# EAGLE design v1 (EAGLE 9.3.0)
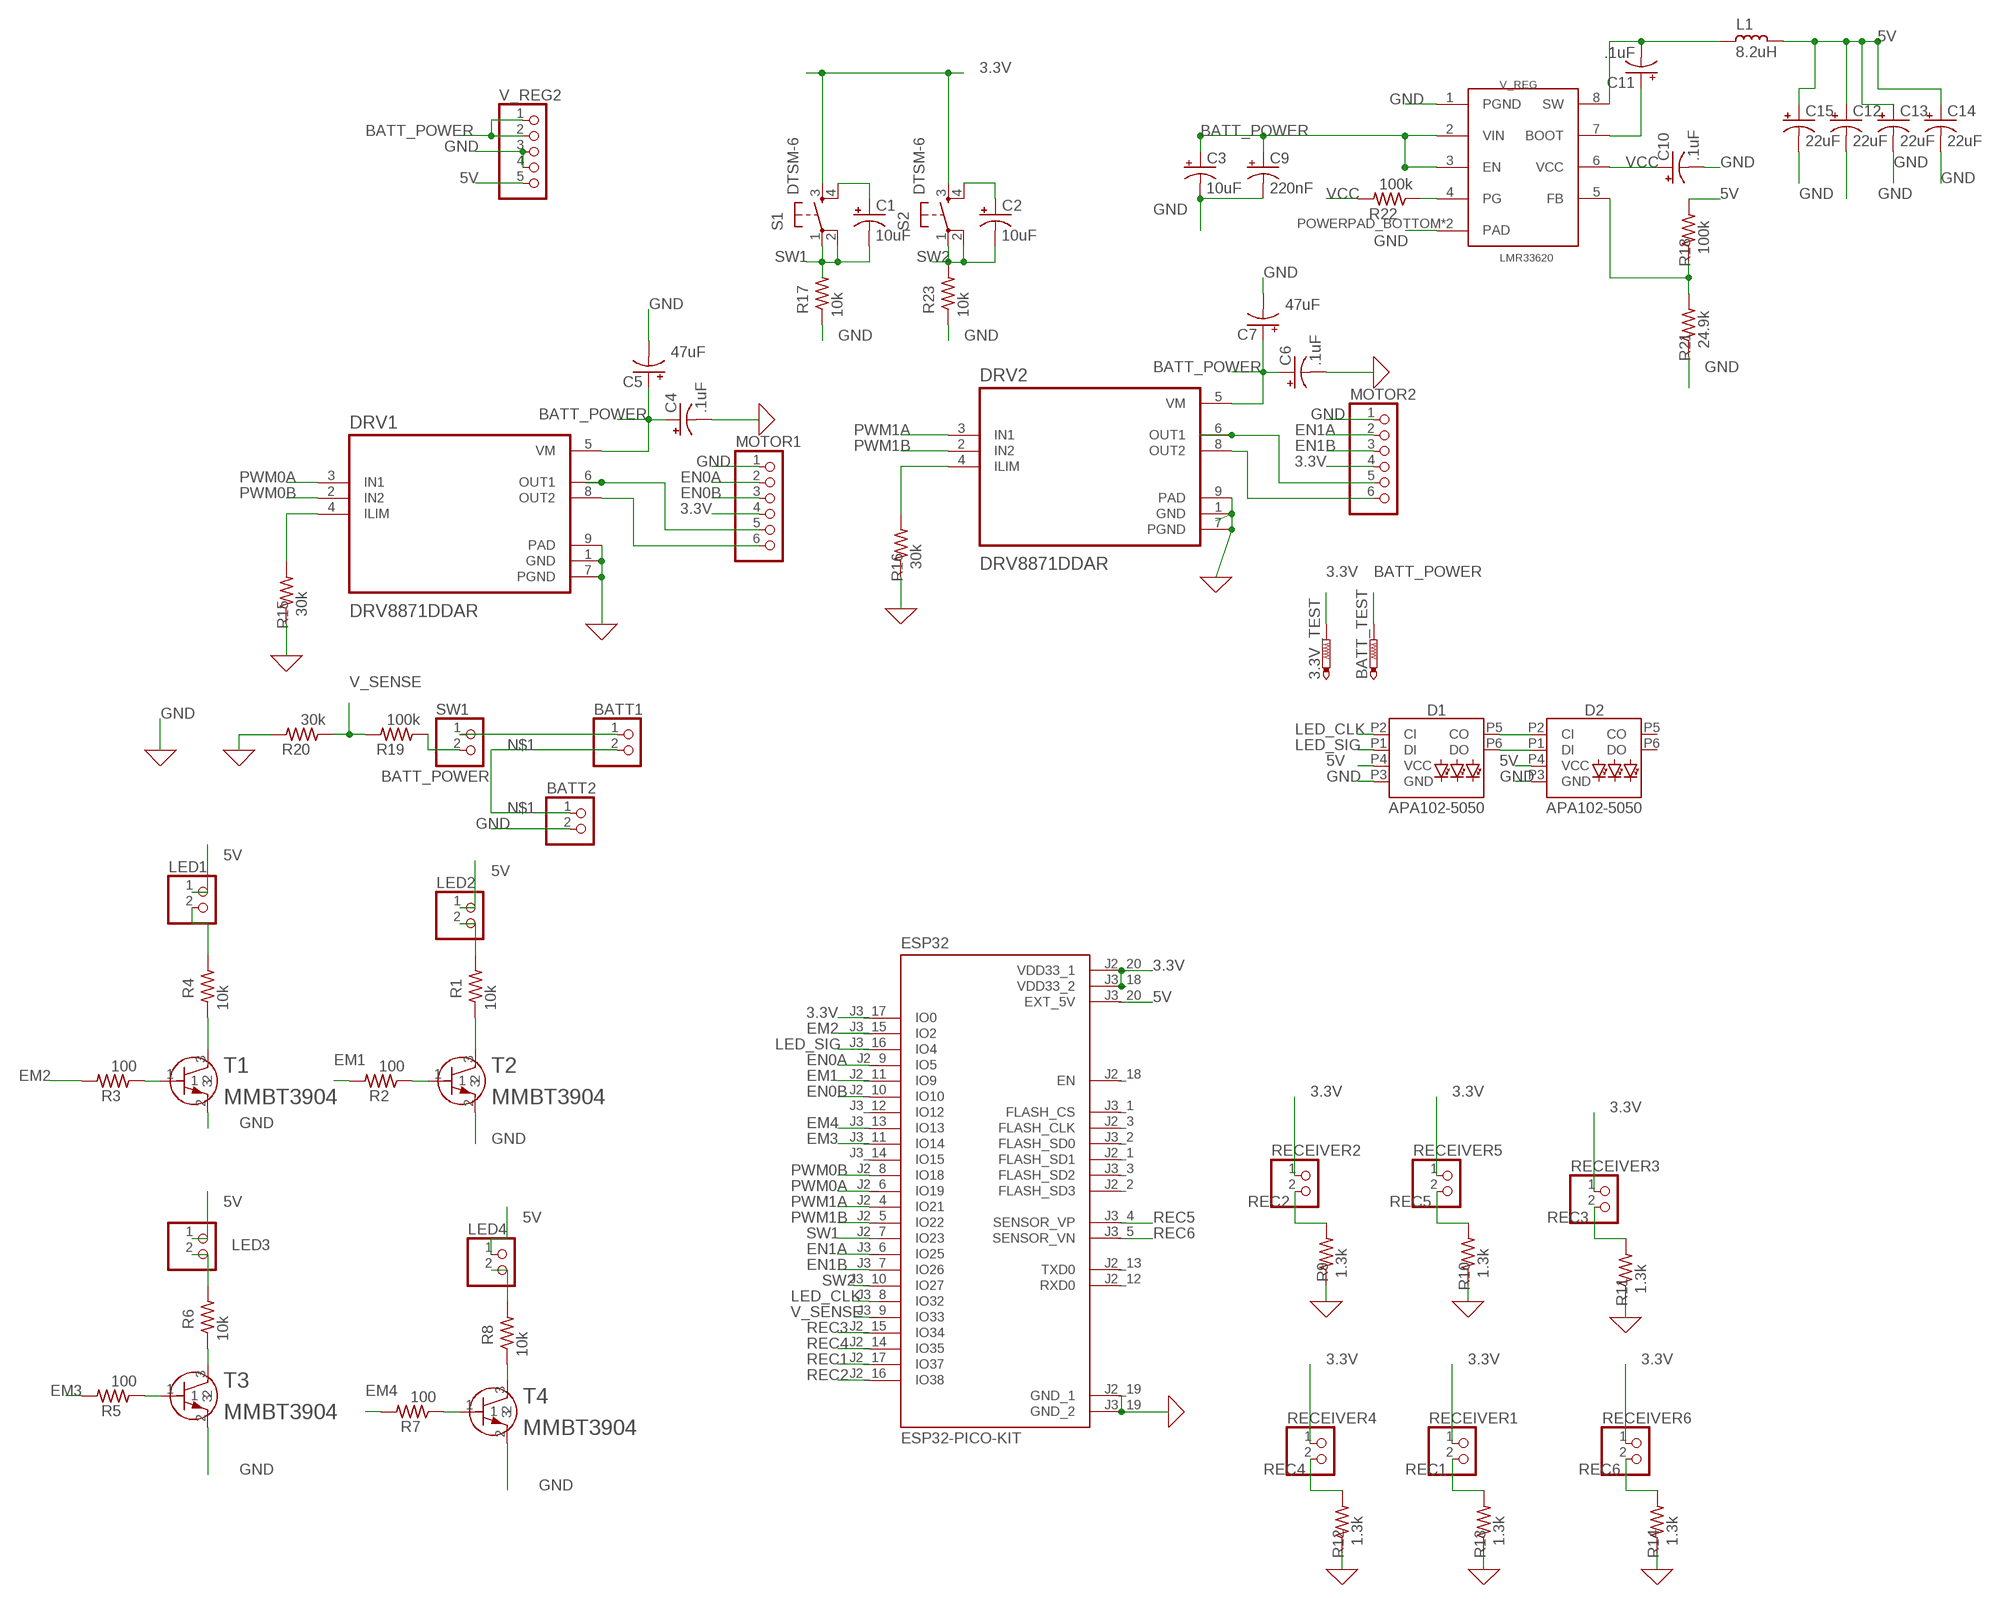
[diagram p0: schematic, sheet 1]

## Parts
3.3V_TEST  PTR1B1,27  [B1,27]
BATT1  PINHD-1X2  [1X02]
BATT2  PINHD-1X2  [1X02]
BATT_TEST  PTR1B1,27  [B1,27]
C1  10uF  CPOL-USA/3216-18R  [A/3216-18R]
C2  10uF  CPOL-USA/3216-18R  [A/3216-18R]
C3  10uF  CPOL-USA/3216-18R  [A/3216-18R]
C4  .1uF  CPOL-USA/3216-18R  [A/3216-18R]
C5  47uF  CPOL-US150CLZ-0810  [150CLZ-0810]
C6  .1uF  CPOL-USA/3216-18R  [A/3216-18R]
C7  47uF  CPOL-US150CLZ-0810  [150CLZ-0810]
C9  220nF  CPOL-USA/3216-18R  [A/3216-18R]
C10  .1uF  CPOL-USA/3216-18R  [A/3216-18R]
C11  .1uF  CPOL-USA/3216-18R  [A/3216-18R]
C12  22uF  CPOL-USA/3216-18R  [A/3216-18R]
C13  22uF  CPOL-USA/3216-18R  [A/3216-18R]
C14  22uF  CPOL-USA/3216-18R  [A/3216-18R]
C15  22uF  CPOL-USA/3216-18R  [A/3216-18R]
D1  APA102-5050  [APA102-5050]
D2  APA102-5050  [APA102-5050]
DRV1  DRV8871DDAR  [SOIC127P600X170-8N]
DRV2  DRV8871DDAR  [SOIC127P600X170-8N]
ESP32  ESP32-PICO-KIT  [XCVR_ESP32-PICO-KIT]
L1  8.2uH  L_PM1812  [PM1812]
LED1  PINHD-1X2  [1X02]
LED2  PINHD-1X2  [1X02]
LED3  PINHD-1X2  [1X02]
LED4  PINHD-1X2  [1X02]
MOTOR1  PINHD-1X6  [1X06]
MOTOR2  PINHD-1X6  [1X06]
R1  10k  R-US_M1206  [M1206]
R2  100  R-US_M1206  [M1206]
R3  100  R-US_M1206  [M1206]
R4  10k  R-US_M1206  [M1206]
R5  100  R-US_M1206  [M1206]
R6  10k  R-US_M1206  [M1206]
R7  100  R-US_M1206  [M1206]
R8  10k  R-US_M1206  [M1206]
R9  1.3k  R-US_M1206  [M1206]
R10  1.3k  R-US_M1206  [M1206]
R11  1.3k  R-US_M1206  [M1206]
R12  1.3k  R-US_M1206  [M1206]
R13  1.3k  R-US_M1206  [M1206]
R14  1.3k  R-US_M1206  [M1206]
R15  30k  R-US_M1206  [M1206]
R16  30k  R-US_M1206  [M1206]
R17  10k  R-US_M1206  [M1206]
R18  100k  R-US_M1206  [M1206]
R19  100k  R-US_M1206  [M1206]
R20  30k  R-US_M1206  [M1206]
R21  24.9k  R-US_M1206  [M1206]
R22  100k  R-US_M1206  [M1206]
R23  10k  R-US_M1206  [M1206]
RECEIVER1  PINHD-1X2  [1X02]
RECEIVER2  PINHD-1X2  [1X02]
RECEIVER3  PINHD-1X2  [1X02]
RECEIVER4  PINHD-1X2  [1X02]
RECEIVER5  PINHD-1X2  [1X02]
RECEIVER6  PINHD-1X2  [1X02]
S1  DTSM-6  [DTSM-6]
S2  DTSM-6  [DTSM-6]
SW1  PINHD-1X2  [1X02]
T1  MMBT3904  [SOT23]
T2  MMBT3904  [SOT23]
T3  MMBT3904  [SOT23]
T4  MMBT3904  [SOT23]
V_REG  LMR33620  [SO-8_POWERPAD]
V_REG2  PINHD-1X5  [1X05]

## Nets
3.3V: 3.3V_TEST.TP ESP32.J2_20(VDD33_1) ESP32.J3_17(IO0) ESP32.J3_18(VDD33_2) MOTOR1.4 MOTOR2.4 RECEIVER1.1 RECEIVER2.1 RECEIVER3.1 RECEIVER4.1 RECEIVER5.1 RECEIVER6.1 S1.3 S2.3
5V: C12.+ C13.+ C14.+ C15.+ D1.P4(VCC) D2.P4(VCC) ESP32.J3_20(EXT_5V) L1.1 LED1.1 LED2.1 LED3.1 LED4.1 R18.2 V_REG2.5
BATT_POWER: BATT_TEST.TP C3.+ C4.+ C5.+ C6.+ C7.+ C9.+ DRV1.5(VM) DRV2.5(VM) R19.1 SW1.2 V_REG2.1 V_REG2.2 V_REG.2(VIN) V_REG.3(EN)
EM1: ESP32.J2_11(IO9) R2.2
EM2: ESP32.J3_15(IO2) R3.2
EM3: ESP32.J3_11(IO14) R5.2
EM4: ESP32.J3_13(IO13) R7.2
EN0A: ESP32.J2_9(IO5) MOTOR1.2
EN0B: ESP32.J2_10(IO10) MOTOR1.3
EN1A: ESP32.J3_6(IO25) MOTOR2.2
EN1B: ESP32.J3_7(IO26) MOTOR2.3
GND: BATT2.2 C3.- C4.- C5.- C6.- C7.- C9.- C10.- C12.- C13.- C14.- C15.- D1.P3(GND) D2.P3(GND) DRV1.1(GND) DRV1.7(PGND) DRV1.9(PAD) DRV2.1(GND) DRV2.7(PGND) DRV2.9(PAD) ESP32.J2_19(GND_1) ESP32.J3_19(GND_2) MOTOR1.1 MOTOR2.1 R9.1 R10.1 R11.1 R12.1 R13.1 R14.1 R15.1 R16.1 R17.1 R20.2 R21.1 R23.1 T1.2 T2.2 T3.2 T4.2 V_REG2.3 V_REG2.4 V_REG.1(PGND) V_REG.POWERPAD_BOTTOM(PAD) V_REG.POWERPAD_TOP(PAD)
LED3: LED3.2 R6.2
LED_CLK: D1.P2(CI) ESP32.J3_8(IO32)
LED_SIG: D1.P1(DI) ESP32.J3_16(IO4)
N$1: BATT1.2 BATT2.1
N$3: BATT1.1 SW1.1
N$4: C1.+ S1.4
N$5: R2.1 T2.1
N$6: LED2.2 R1.2
N$7: R1.1 T2.3
N$8: LED1.2 R4.2
N$9: R4.1 T1.3
N$10: R5.1 T3.1
N$12: R6.1 T3.3
N$13: R7.1 T4.1
N$14: LED4.2 R8.2
N$15: R8.1 T4.3
N$16: DRV1.8(OUT2) MOTOR1.6
N$17: DRV1.6(OUT1) MOTOR1.5
N$18: DRV2.8(OUT2) MOTOR2.6
N$19: DRV2.6(OUT1) MOTOR2.5
N$20: DRV2.4(ILIM) R16.2
N$22: C2.+ S2.4
N$23: R18.1 R21.2 V_REG.5(FB)
N$24: DRV1.4(ILIM) R15.2
N$25: C11.+ V_REG.7(BOOT)
N$26: C11.- L1.2 V_REG.8(SW)
N$34: D1.P5(CO) D2.P2(CI)
N$35: D1.P6(DO) D2.P1(DI)
PG: R22.1 V_REG.4(PG)
PWM0A: DRV1.3(IN1) ESP32.J2_6(IO19)
PWM0B: DRV1.2(IN2) ESP32.J2_8(IO18)
PWM1A: DRV2.3(IN1) ESP32.J2_4(IO21)
PWM1B: DRV2.2(IN2) ESP32.J2_5(IO22)
REC1: ESP32.J2_17(IO37) R13.2 RECEIVER1.2
REC2: ESP32.J2_16(IO38) R9.2 RECEIVER2.2
REC3: ESP32.J2_15(IO34) R11.2 RECEIVER3.2
REC4: ESP32.J2_14(IO35) R12.2 RECEIVER4.2
REC5: ESP32.J3_4(SENSOR_VP) R10.2 RECEIVER5.2
REC6: ESP32.J3_5(SENSOR_VN) R14.2 RECEIVER6.2
SW1: C1.- ESP32.J2_7(IO23) R17.2 S1.1 S1.2
SW2: C2.- ESP32.J3_10(IO27) R23.2 S2.1 S2.2
T1: R3.1 T1.1
V_SENSE: ESP32.J3_9(IO33) R19.2 R20.1
VCC: C10.+ R22.2 V_REG.6(VCC)
Unconnected: D2.P5(CO) D2.P6(DO) ESP32.J2_1(FLASH_SD1) ESP32.J2_2(FLASH_SD3) ESP32.J2_3(FLASH_CLK) ESP32.J2_12(RXD0) ESP32.J2_13(TXD0) ESP32.J2_18(EN) ESP32.J3_1(FLASH_CS) ESP32.J3_2(FLASH_SD0) ESP32.J3_3(FLASH_SD2) ESP32.J3_12(IO12) ESP32.J3_14(IO15)

## Library data of the parts
3.3V_TEST BATT_TEST = testpad:PTR1: TEST PIN
BATT1 BATT2 LED1-LED4 RECEIVER1-RECEIVER6 SW1 = pinhead:PINHD-1X2: PIN HEADER
C1-C7 C9-C15 = rcl:CPOL-US: POLARIZED CAPACITOR, American symbol; SPICEPREFIX: C
D1 D2 = SparkFun-LED:APA102: APA102 Addressable RGB LED Used in manufacturing of various products at SparkFun Packages: 5050 2020 SparkFun Products: SparkFun Lumenati Boards <https://www.sparkfun.com/categories/405>; PROD_ID: DIO-13739
DRV1 DRV2 = DRV8871DDAR:DRV8871DDAR: 3.6A Brushed DC Motor Driver with Integrated Current Sensing (PWM Ctrl) 8-SO PowerPAD -40 to 125; DESCRIPTION: 3.6A Brushed DC Motor Driver with Integrated Current Sensing _PWM Ctrl_ 8-SO PowerPAD -40 to 125; DIGI-KEY_PART_NUMBER: 296-43024-1-ND; DIGI-KEY_PURCHASE_URL: https://www.digikey.com/product-detail/en/texas-instruments/DRV8871DDAR/296-43024-1-ND/5722182?utm_source=snapeda&utm_medium=aggregator&utm_campaign=symbol; MF: Texas Instruments; MP: DRV8871DDAR; PACKAGE: SO-8 Texas Instruments
ESP32 = ESP32-PICO-KIT:ESP32-PICO-KIT: Esp32 Wifi Bluetooth Eval Board; AVAILABILITY: Unavailable; DESCRIPTION: Esp32 Wifi Bluetooth Eval Board; MF: Espressif Systems; MP: ESP32-PICO-KIT; PACKAGE: None; PRICE: None
L1 = rc-master-smd:L_: INDUCTOR
MOTOR1 MOTOR2 = pinhead:PINHD-1X6: PIN HEADER
R1-R23 = rcl:R-US_: RESISTOR, American symbol; SPICEPREFIX: R
S1 S2 = switch-tact:DTSM-6
T1-T4 = transistors:MMBT3904; MANUFACTURER_PART_NUMBER: MMBT3904; VENDOR: NXP
V_REG = LMR33620:LMR33620
V_REG2 = pinhead:PINHD-1X5: PIN HEADER

## Board
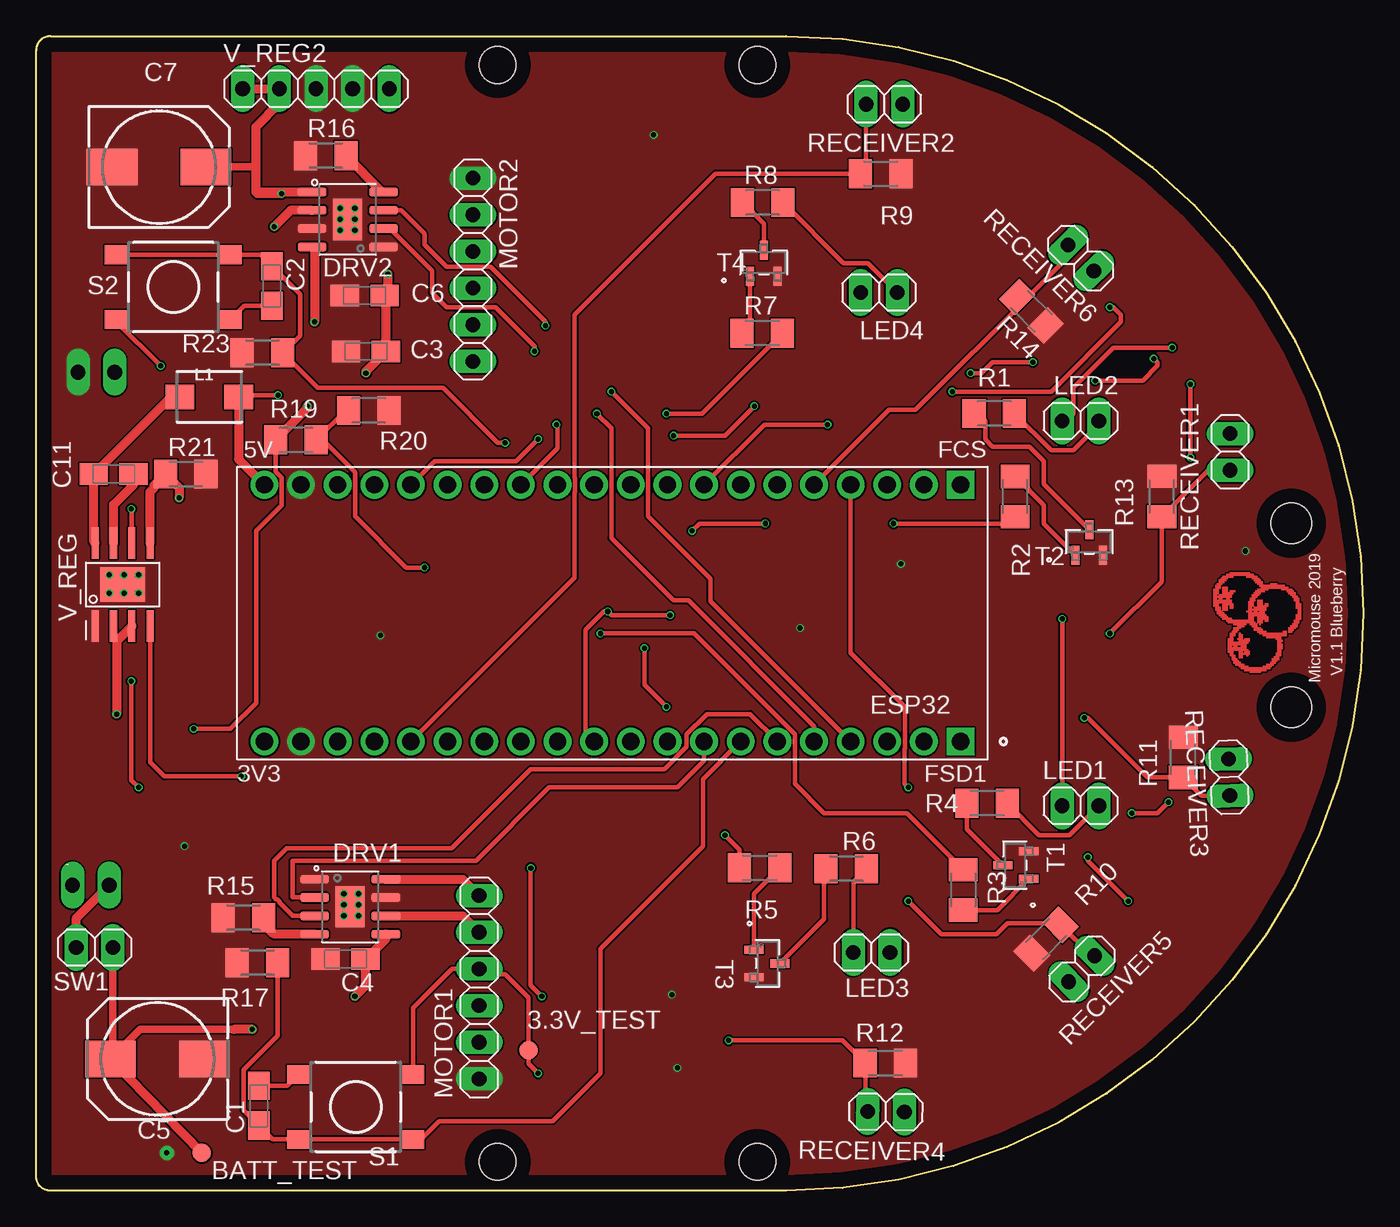
[diagram p1: board, top side]
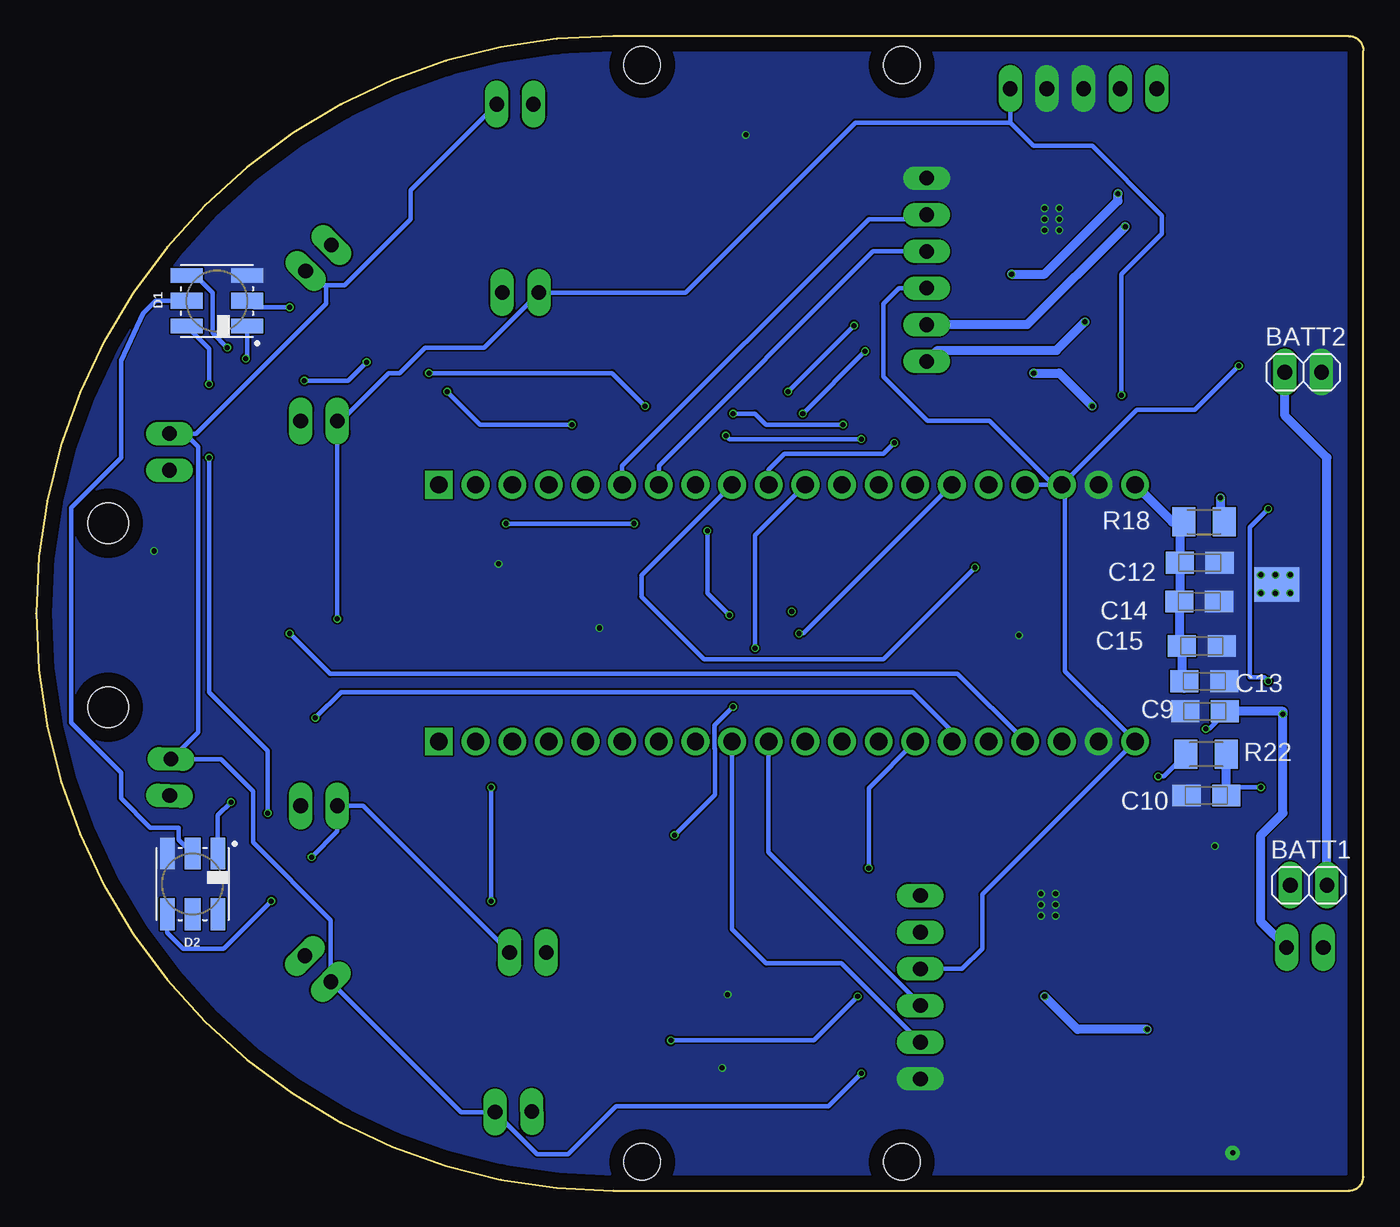
[diagram p2: board, bottom side, seen from below]

Size 92 x 80 mm. Coordinates in mm from the lower left corner, seen from the top.
Outline: 52,0 1,0 arc-90 0,1 0,79 arc-90 1,80 52,80 arc-180 52,0
Copper layers (1*16): Top 0.035mm / dielectric 1.5mm / Bottom 0.035mm
Design rules "jlcpcb *": minimum track width 3.5mil, minimum drill 0.2mm, track to track 5mil, track to pad 3.5mil, pad to pad 6mil, via to via 6mil, smd to smd 6mil, copper to edge 1mm, drill to drill 0.2mm, minimum pad ring 3mil, minimum via ring 3mil, stop-mask expansion 4mil, vias tented up to drill 0mil, thermal gap 10mil
Holes 2.8 mm at 87,33.5 87,46.25
Holes 2.54 mm at 32,2 50,2 32,78 50,78

### Footprints (pad centres in the part's own frame; a part is rotated, then mirrored left to right if it is on the bottom)
B1,27 = smd 1.27 x 1.27: TP 0,0
1X02 = drill 1.016 long: 1 -1.27,0; 2 1.27,0
A/3216-18R = smd 1.95 x 1.5: + 1.375,0; - -1.375,0
150CLZ-0810 = smd 3.5 x 2.5: + 3.25,0; - -3.25,0
APA102-5050 = smd 1 x 2.2: P1 -1.75,-2.1; P3 1.75,-2.1; P4 1.75,2.1; P6 -1.75,2.1 | smd 1.1 x 2.2: P2 0,-2.1; P5 0,2.1
SOIC127P600X170-8N = smd 1.97 x 0.6: 1 -2.475,1.905; 2 -2.475,0.635; 3 -2.475,-0.635; 4 -2.475,-1.905; 5 2.475,-1.905; 6 2.475,-0.635; 7 2.475,0.635; 8 2.475,1.905 | smd 2.02 x 2.87: 9 0,0
XCVR_ESP32-PICO-KIT = drill 1.2 square: J2_1 -24.13,8.89; J3_1 -24.13,-8.89 | drill 1.2: J2_2 -21.59,8.89; J2_3 -19.05,8.89; J2_4 -16.51,8.89; J2_5 -13.97,8.89; J2_6 -11.43,8.89; J2_7 -8.89,8.89; J2_8 -6.35,8.89; J2_9 -3.81,8.89; J2_10 -1.27,8.89; J2_11 1.27,8.89; J2_12 3.81,8.89; J2_13 6.35,8.89; J2_14 8.89,8.89; J2_15 11.43,8.89; J2_16 13.97,8.89; J2_17 16.51,8.89; J2_18 19.05,8.89; J2_19 21.59,8.89; J2_20 24.13,8.89; J3_2 -21.59,-8.89; J3_3 -19.05,-8.89; J3_4 -16.51,-8.89; J3_5 -13.97,-8.89; J3_6 -11.43,-8.89; J3_7 -8.89,-8.89; J3_8 -6.35,-8.89; J3_9 -3.81,-8.89; J3_10 -1.27,-8.89; J3_11 1.27,-8.89; J3_12 3.81,-8.89; J3_13 6.35,-8.89; J3_14 8.89,-8.89; J3_15 11.43,-8.89; J3_16 13.97,-8.89; J3_17 16.51,-8.89; J3_18 19.05,-8.89; J3_19 21.59,-8.89; J3_20 24.13,-8.89
PM1812 = smd 2 x 1.7: 1 -2.032,0; 2 2.032,0
1X06 = drill 1.016 long: 1 -6.35,0; 2 -3.81,0; 3 -1.27,0; 4 1.27,0; 5 3.81,0; 6 6.35,0
M1206 = smd 1.6 x 2: 1 -1.4,0; 2 1.4,0
DTSM-6 = smd 1.55 x 1.3: 1 -3.975,2.25; 2 3.975,2.25; 3 -3.975,-2.25; 4 3.975,-2.25
SOT23 = smd 0.559 x 1.321: 1 -0.953,-0.945; 2 0.953,-0.945; 3 0,0.847
SO-8_POWERPAD = smd 0.5 x 2.2: 1 -1.905,-2.875; 2 -0.635,-2.875; 3 0.635,-2.875; 4 1.905,-2.875; 5 1.905,2.875; 6 0.635,2.875; 7 -0.635,2.875; 8 -1.905,2.875 | smd 3.1 x 2.4 bottom: POWERPAD_BOTTOM 0,0 | smd 3.1 x 2.4: POWERPAD_TOP 0,0
1X05 = drill 1.016 long: 1 -5.08,0; 2 -2.54,0; 3 0,0; 4 2.54,0; 5 5.08,0

### Placement (x,y rotation side)
3.3V_TEST  34.13,9.74 0 top
BATT1  3.8,21.17 0 bottom
BATT2  4.18,56.71 0 bottom
BATT_TEST  11.49,2.63 0 top
C1  15.44,5.9 90 top
C2  16.35,62.68 270 top
C3  22.87,58.16 0 top
C4  21.45,16.05 0 top
C5  8.42,9.12 180 top
C6  22.78,62.03 0 top
C7  8.53,70.93 0 top
C9  10.98,33.22 0 bottom
C10  10.88,27.38 0 bottom
C11  5.38,49.65 0 top
C12  11.34,43.51 180 bottom
C13  11.03,35.3 180 bottom
C14  11.38,40.83 180 bottom
C15  11.2,37.74 180 bottom
D1  79.46,61.65 90 bottom
D2  81.15,21.26 180 bottom
DRV1  21.77,19.68 0 top
DRV2  21.61,67.29 180 top
ESP32  39.95,40.02 180 top
L1  12,55 180 top
LED1  72.39,26.67 0 top
LED2  72.39,53.34 0 top
LED3  57.91,16.51 180 top
LED4  58.42,62.23 0 top
MOTOR1  30.71,14.09 90 top
MOTOR2  30.28,63.81 270 top
R1  66.42,53.85 0 top
R2  67.86,48.09 270 top
R3  64.26,20.85 90 top
R4  65.91,26.85 0 top
R5  50.17,22.38 180 top
R6  56.15,22.31 0 top
R7  50.33,59.42 0 top
R8  50.35,68.47 0 top
R9  58.55,70.47 180 top
R10  70.02,17.44 45 top
R11  79.5,30.03 270 top
R12  58.87,8.85 180 top
R13  78.02,48.09 270 top
R14  68.99,60.93 135 top
R15  14.37,18.91 0 top
R16  20.08,71.71 0 top
R17  15.35,15.79 0 top
R18  11.04,46.34 180 bottom
R19  18.01,52.02 0 top
R20  23.07,54.06 0 top
R21  10.37,49.66 180 top
R22  10.9,30.23 0 bottom
R23  15.7,58.06 0 top
RECEIVER1  82.76,51.19 270 top
RECEIVER2  58.8,75.28 180 top
RECEIVER3  82.69,28.64 272.2 top
RECEIVER4  58.91,5.47 179.2 top
RECEIVER5  72.47,15.38 45 top
RECEIVER6  72.42,64.63 135 top
S1  22.16,5.8 180 top
S2  9.51,62.61 0 top
SW1  4.05,16.86 0 top
T1  67.85,22.56 90 top
T2  72.99,44.96 0 top
T3  50.7,15.74 270 top
T4  50.44,64.31 0 top
V_REG  6,42 0 top
V_REG2  19.4,76.35 0 top

### Tracks (layer width: path | path; a pad name or v marks a point on that pad's centre or on a via)
3.3V  (via drill 0.35)
  Top 0.305: S1.3 26.13,12.67 28.82,15.36 MOTOR1.4 31.08,14.99 32.51,14.99 34.13,13.37 3.3V_TEST.TP 34.13,8.8 v34.8,8.13 | v8.64,57.15 5.54,60.25 S2.3
  Bottom 0.305: MOTOR1.4 27.82,15.36 26.42,16.76 26.42,20.53 ESP32.J2_20 20.68,35.99 20.68,48.77 | RECEIVER2.1 66.04,69.31 66.04,67.31 70.61,62.74 71.88,62.74 | 71.88,62.74 72.32,62.74 RECEIVER6.1 | 71.88,62.74 71.88,61.47 80.89,52.46 RECEIVER1.1 81.67,52.46 80.77,51.56 80.77,31.78 RECEIVER3.1 79.19,29.91 76.96,27.69 76.96,24.13 71.58,18.74 RECEIVER5.1 62.55,5.45 60.2,5.45 | 60.2,5.45 RECEIVER4.1 | v34.8,8.13 37.08,5.84 51.82,5.84 55.12,2.54 57.29,2.54 60.2,5.45 | 20.68,49.13 ESP32.J3_18 21.48,48.91 25.91,53.34 30.23,53.34 33.27,56.39 33.27,61.47 32.2,62.54 MOTOR2.4 | 20.68,49.13 15.71,54.1 11.68,54.1 v8.64,57.15 | 20.68,48.77 20.68,49.13 | ESP32.J3_17 20.82,48.91 20.68,48.77
5V  (via drill 0.35)
  Top 0.305: L1.1 14.15,55.12 v16.76,55.12 | LED1.1 v71.12,39.62 | LED2.1 71.37,53.34 71.88,53.85 71.88,55.63 74.68,58.42 v78.74,58.42 | v75.69,20.07 72.9,22.86 v72.9,23.11
  Top 0.61: L1.1 14.03,50.7 ESP32.J3_20
  Bottom 0.305: v16.76,55.12 16.76,63.5 13.97,66.29 13.97,67.56 18.8,72.39 22.86,72.39 24.48,74.01 | 24.48,74.01 V_REG2.5 | 24.48,74.01 35.21,74.01 46.99,62.23 LED4.1 60.96,58.42 65.02,58.42 66.8,56.64 67.56,56.64 70.87,53.34 LED2.1 v71.12,39.62 | LED3.1 69.34,26.67 LED1.1 71.12,24.89 v72.9,23.11 | v78.74,58.42 79.76,59.44 79.76,62.23 80.92,63.4 D1.P4 | D2.P4 82.9,17.88 81.79,16.76 78.99,16.76 v75.69,20.07
  Bottom 0.61: ESP32.J3_20 13.25,46.34 R18.2 12.72,46.06 C12.+ 12.72,40.87 C14.+ 12.76,37.92 C15.+ 12.58,34.93 12.45,34.8 12.4,34.84 C13.+
BATT_POWER  (via drill 0.35)
  Top 0.305: R19.1 16.61,49.82 17.02,49.41 17.02,47.51 15.24,45.72 15.24,33.78 13.46,32 v10.92,32 | V_REG.2 5.37,38.3 5.59,38.08
  Top 0.508: SW1.2 5.32,9.28 | 5.32,9.28 C5.+ | 13.72,11.18 7.22,11.18 5.32,9.28 | C7.+ 15.18,70.93 15.24,70.87
  Top 0.61: DRV1.5 24.25,17.47 C4.+ 22.83,14.19 v22.1,13.46 | v14.99,11.18 13.72,11.18 | V_REG.3 5.59,38.08 v5.59,33.02 | V_REG2.1 V_REG2.2 16.86,75.34 15.24,73.72 15.24,70.87 15.24,69.2 | DRV2.5 15.24,69.2 | v22.86,56.64 22.86,56.77 C3.+ 24.25,61.93 C6.+ 24.38,62.26 v24.38,63.5 | R19.1 18.8,54.2 v18.8,54.36 | v17.02,69.09 15.35,69.09 15.24,69.2 | BATT_TEST.TP C5.+
  Bottom 0.305: v10.92,32 10.67,32 9.46,33.21 9.47,33.22 C9.+
  Bottom 0.61: v14.99,11.18 19.81,11.18 v22.1,13.46 | 9.46,33.21 5.59,33.21 v5.59,33.02 5.59,26.16 7.11,24.64 7.11,18.64 SW1.2 | v22.86,56.64 21.08,56.64 v18.8,54.36 | v24.38,63.5 22.1,63.5 17.02,68.58 v17.02,69.09
EM1  (via drill 0.35)
  Top 0.305: R2.2 67.4,46.23 v59.44,46.23 | v50.55,46.23 45.97,46.23 v45.47,45.72 | v43.94,39.88 39.88,39.88 v39.62,40.13 39.37,40.13 38.1,38.86 38.1,31.71 ESP32.J2_11
  Bottom 0.305: v59.44,46.23 v50.55,46.23 | v45.47,45.72 45.47,41.4 v43.94,39.88
EM2  (via drill 0.35)
  Top 0.305: v39.12,38.61 45.6,38.61 52.59,31.63 52.59,28.19 54.61,26.16 60.35,26.16 R3.2
  Bottom 0.305: ESP32.J3_15 38.82,38.61 v39.12,38.61
EM3  (via drill 0.35)
  Top 0.305: v42.16,37.59 42.16,35.05 v43.69,33.53 | v47.75,24.64 48.77,23.62 R5.2
  Bottom 0.305: ESP32.J3_11 42.16,45.42 v42.16,37.59 | v43.69,33.53 44.97,32.25 44.97,30.63 44.96,30.62 44.96,27.43 v47.75,24.64
EM4  (via drill 0.35)
  Top 0.305: R7.2 46.16,53.85 v43.69,53.85 | v36.07,53.09 36.14,53.01 36.14,51.45 ESP32.J3_13
  Bottom 0.305: v43.69,53.85 42.16,53.85 41.4,53.09 v36.07,53.09
EN0A
  Bottom 0.305: MOTOR1.2 36.17,15.75 41.4,15.75 43.76,18.11 ESP32.J2_9
EN0B
  Bottom 0.305: MOTOR1.3 30.71,12.93 41.22,23.44 ESP32.J2_10
EN1A
  Bottom 0.305: ESP32.J3_6 51.38,50.22 34.29,67.31 30.59,67.31 MOTOR2.2
EN1B
  Bottom 0.305: MOTOR2.3 33.98,65.08 48.84,50.22 ESP32.J3_7
GND  (via drill 0.35, 0.35 pad 1)
  other vias: 21.08,68.07 22.1,68.07 21.08,67.31 22.1,67.31 22.1,66.55 21.08,66.55 21.34,20.57 22.35,20.57 21.34,19.81 22.35,19.81 21.34,19.05 22.35,19.05 5.08,42.67 6.1,42.67 7.11,42.67 5.08,41.4 6.1,41.4 7.11,41.4 42.8,73.15 23.88,38.48 59.94,43.43 83.82,44.32 44.45,8.51 44.07,13.59 10.29,23.88 52.96,38.99 9.06,2.63
  pour Top (no thermals): 0,78.97 0,0.97 arc90 1,-0.03 52,-0.03 arc180 52,79.97 1,79.97 arc90
  pour Bottom (no thermals): 0,78.97 0,0.97 arc90 1,-0.03 52,-0.03 arc180 52,79.97 1,79.97 arc90
LED3
  Top 0.305: LED3.2 56.64,21.4 R6.2
LED_CLK  (via drill 0.35)
  Top 0.305: ESP32.J3_8 50.48,53.09 v54.86,53.09 | v63.5,55.37 70.36,55.37 75.18,60.2 75.18,60.71 74.68,61.21 v74.42,61.21
  Bottom 0.305: v54.86,53.09 61.21,53.09 v63.5,55.37 | v74.42,61.21 76.93,61.21 D1.P2
LED_SIG  (via drill 0.35)
  Top 0.305: v77.47,57.66 77.72,57.4 77.72,57.15 76.71,56.13 v73.41,56.13 | v69.09,57.4 66.29,57.4 65.53,56.64 v64.77,56.64 | v49.78,54.36 47.75,52.32 v44.2,52.32 | v34.8,52.07 33.27,50.55 27.62,50.55 ESP32.J3_16
  Bottom 0.305: D1.P1 77.36,57.76 v77.47,57.66 | v73.41,56.13 70.36,56.13 v69.09,57.4 | v64.77,56.64 52.07,56.64 v49.78,54.36 | v44.2,52.32 43.94,52.07 v34.8,52.07
N$1
  Bottom 0.61: BATT1.2 2.53,50.79 5.45,53.71 BATT2.1
N$3
  Top 0.61: SW1.1 2.78,18.88 BATT1.1
N$4
  Top 0.305: C1.+ 17.41,7.27 S1.4
N$5
  Top 0.305: T2.1 69.85,46.2 69.85,47.5 R2.1
N$6
  Top 0.305: R1.2 70.36,51.31 71.88,51.31 73.91,53.34 LED2.2
N$7
  Top 0.305: T2.3 69.85,48.95 69.85,50.55 68.83,51.56 66.29,51.56 65.78,52.07 65.78,53.34 65.27,53.85 R1.1
N$8
  Top 0.305: R4.2 69.52,24.64 71.63,24.64 LED1.2
N$9
  Top 0.305: T1.3 64.51,25.05 R4.1
N$10
  Top 0.305: T3.1 49.75,20.57 R5.1
N$12
  Top 0.305: T3.3 54.61,18.81 54.61,22.17 R6.1
N$13
  Top 0.305: R7.1 49.49,59.98 T4.1
N$14
  Top 0.305: LED4.2 57.66,64.26 55.96,64.26 R8.2
N$15
  Top 0.305: T4.3 50.44,66.98 R8.1
N$16
  Top 0.61: DRV1.8 29.57,21.58 MOTOR1.6
N$17
  Top 0.61: DRV1.6 29.57,19.04 MOTOR1.5
N$18  (via drill 0.35)
  Top 0.61: DRV2.8 19.3,65.21 v19.3,60.2
  Bottom 0.61: v19.3,60.2 21.28,58.22 29.52,58.22 MOTOR2.6
N$19  (via drill 0.35)
  Top 0.61: DRV2.6 17.64,67.93 v16.51,66.8
  Bottom 0.61: v16.51,66.8 23.31,60 MOTOR2.5
N$20
  Top 0.61: DRV2.4 24,69.2 R16.2
N$22
  Top 0.305: S2.4 14.44,61.31 C2.+
N$23  (via drill 0.35)
  Top 0.61: V_REG.5 7.91,48.43 8.19,48.71 8.19,48.87 R21.2 9.91,48.72 v9.91,48.01
  Bottom 0.61: v9.91,48.01 9.91,46.6 R18.1
N$24
  Top 0.61: DRV1.4 19.29,17.78 16.51,17.78 15.77,18.52 R15.2
N$25
  Top 0.61: V_REG.7 5.37,47.53 6.75,48.92 C11.+
N$26
  Top 0.61: V_REG.8 4,44.97 C11.- 9.36,55 L1.2
N$34
  Bottom 0.305: D2.P2 82.1,24.3 82.1,25.15 84.07,25.15 86.11,27.18 86.11,28.97 89.57,32.44 89.57,47.31 86.11,50.78 86.11,57.51 84.58,60.78 83.71,61.65 D1.P5
N$35  (via drill 0.35)
  Top 0.305: v75.95,26.16 77.72,26.16 v78.49,26.92 | v80.01,50.8 v80.01,55.88
  Bottom 0.305: v80.01,50.8 80.01,34.54 75.95,30.48 v75.95,26.16 | v78.49,26.92 79.4,26.01 D2.P1 | D1.P6 80.01,58.34 v80.01,55.88
PG  (via drill 0.35)
  Top 0.305: v14.22,28.7 8.89,28.7 7.91,29.69 V_REG.4
  Bottom 0.305: v14.22,28.7 13.83,28.7 R22.1
PWM0A
  Top 0.305: DRV1.3 19.29,19.05 17.78,19.05 16.87,19.96 16.87,20.03 16.69,20.21 16.62,20.21 16.51,20.32 16.51,22.86 17.39,23.73 28.82,23.73 34.29,29.21 43.55,29.21 45.09,30.76 45.09,31.63 46.49,33.02 49.49,33.02 ESP32.J2_6
PWM0B
  Top 0.305: DRV1.2 19.29,20.32 17.78,20.32 17.78,22.86 30.48,22.86 35.56,27.94 36.83,27.94 44.45,27.94 46.3,29.79 ESP32.J2_8
PWM1A  (via drill 0.35)
  Top 0.305: v39.88,55.37 42.42,52.83 42.42,49.41 42.42,48.41 42.42,48.4 42.42,46.74 46.74,42.42 46.74,40.85 ESP32.J2_4 | v35.31,59.94 35.31,60.2 31.5,64.01 28.45,64.01 26.92,65.53 26.92,66.29 25.29,67.93 DRV2.3
  Bottom 0.305: v39.88,55.37 v35.31,59.94
PWM1B  (via drill 0.35)
  Top 0.305: DRV2.2 24.53,66.66 27.43,63.75 27.43,62.23 28.45,61.21 31.84,61.21 34.54,58.51 v34.54,58.17 | v38.86,53.85 39.88,52.83 39.88,48.41 39.88,48.4 39.88,45.21 44.2,40.89 45.21,40.89 53.92,32.19 ESP32.J2_5
  Bottom 0.305: v34.54,58.17 v38.86,53.85
REC1  (via drill 0.35)
  Top 0.305: v74.42,38.61 78.02,42.21 R13.2 81.25,49.92 RECEIVER1.2
  Bottom 0.305: ESP32.J2_17 28.12,35.81 71.63,35.81 v74.42,38.61
REC2
  Top 0.305: RECEIVER2.2 57.53,70.85 R9.2 47.1,70.47 37.34,60.71 37.34,49.41 37.34,48.41 37.34,48.4 37.34,42.49 ESP32.J2_16
REC3  (via drill 0.35)
  Top 0.305: RECEIVER3.2 80.77,27.37 R11.2 77.03,28.63 72.9,32.77 v72.64,32.77
  Bottom 0.305: ESP32.J2_15 28.52,31.82 31.24,34.54 70.87,34.54 v72.64,32.77
REC4  (via drill 0.35)
  Top 0.305: RECEIVER4.2 57.47,5.66 R12.2 57.47,8.83 55.88,10.41 v48.01,10.41 | v34.29,22.35 34.29,14.22 v35.05,13.46
  Bottom 0.305: ESP32.J2_14 34.29,27.9 v34.29,22.35 | v35.05,13.46 38.1,10.41 v48.01,10.41
REC5  (via drill 0.35)
  Top 0.305: RECEIVER5.2 73.16,16.27 R10.2 70.9,18.54 67.31,18.54 66.55,17.78 62.74,17.78 v60.45,20.07 | ESP32.J3_4 56.46,37.27 60.2,33.52 60.2,30.63 60.2,30.62 60.2,28.19 v60.45,27.94
  Bottom 0.305: v60.45,27.94 v60.45,20.07
REC6
  Top 0.305: 69.08,62.24 68.76,61.92 R14.2 | 69.08,62.24 71.52,64.68 RECEIVER6.2 | ESP32.J3_5 59.11,54.1 60.96,54.1 69.08,62.22 69.08,62.24
SW1
  Top 0.305: R17.2 16.75,10.74 14.38,8.37 14.38,5.58 C1.- 16.41,3.55 S1.2 S1.1 26.67,3.55 27.95,4.83 35.81,4.83 39.12,8.13 39.12,16.76 46.23,23.88 46.23,28.52 ESP32.J2_7
SW2  (via drill 0.35)
  Top 0.305: S2.1 S2.2 15.55,64.86 C2.- 18.29,62.12 18.29,59.25 R23.2 19.53,55.63 28.19,55.63 32,51.82 v32.51,51.82
  Bottom 0.305: ESP32.J3_10 41.22,49.97 40.13,51.05 33.27,51.05 v32.51,51.82
T1
  Top 0.305: R3.1 66.64,19.45 T1.1
V_SENSE  (via drill 0.35)
  Top 0.305: R20.1 21.45,54.06 R19.2 19.86,52.02 22.11,49.78 22.11,48.41 22.1,48.4 22.1,46.74 25.65,43.18 v26.92,43.18
  Bottom 0.305: ESP32.J3_9 50.04,42.63 50.04,41.15 45.72,36.83 33.27,36.83 v26.92,43.18
VCC  (via drill 0.35)
  Top 0.305: V_REG.6 6.63,47.21 v6.6,47.24 | v6.6,35.31 6.6,28.45 v7.11,27.94
  Bottom 0.305: v6.6,47.24 7.87,45.97 7.87,35.56 6.86,35.56 v6.6,35.31 | v7.11,27.94 8.95,27.94 C10.+
  Bottom 0.61: C10.+ R22.2
(copper drawn outside any net)
  shapes: Top area x170

### Text on the board
tNames: V1.1 Blueberry | Micromouse 2019